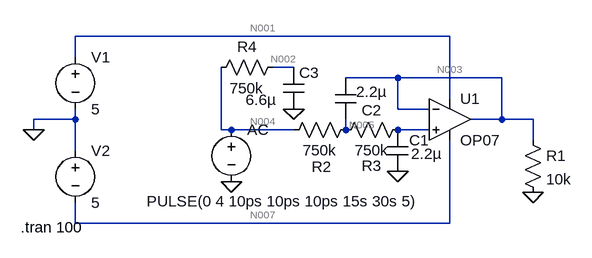
[diagram p0: schematic Draft2.asc]
Draft2.asc, the LTspice schematic file:
Version 4
SHEET 1 880 680
WIRE 176 32 -400 32
WIRE -400 64 -400 32
WIRE -64 80 -96 80
WIRE 96 96 16 96
WIRE 256 96 96 96
WIRE 176 128 176 32
WIRE 96 144 96 96
WIRE 144 144 96 144
WIRE -400 160 -400 144
WIRE -400 160 -464 160
WIRE 256 160 256 96
WIRE 256 160 208 160
WIRE 304 160 256 160
WIRE -464 176 -464 160
WIRE -176 176 -176 80
WIRE -160 176 -176 176
WIRE -64 176 -160 176
WIRE 16 176 16 160
WIRE 144 176 96 176
WIRE 304 192 304 160
WIRE -400 208 -400 160
WIRE -400 320 -400 288
WIRE 176 320 176 192
WIRE 176 320 -400 320
FLAG -464 176 0
FLAG 304 272 0
FLAG 96 240 0
FLAG -160 256 0
FLAG -64 144 0
SYMBOL Opamps\\OP07 176 96 R0
SYMATTR InstName U1
SYMBOL voltage -400 48 R0
WINDOW 123 0 0 Left 2
WINDOW 39 0 0 Left 2
SYMATTR InstName V1
SYMATTR Value 5
SYMBOL voltage -400 192 R0
WINDOW 123 0 0 Left 2
WINDOW 39 0 0 Left 2
SYMATTR InstName V2
SYMATTR Value 5
SYMBOL res 288 176 R0
SYMATTR InstName R1
SYMATTR Value 10k
SYMBOL res 32 160 R90
WINDOW 0 88 53 VBottom 2
WINDOW 3 32 56 VTop 2
SYMATTR InstName R2
SYMATTR Value 750k
SYMBOL cap 112 240 R180
WINDOW 0 -32 48 Left 2
WINDOW 3 -52 27 Left 2
SYMATTR InstName C1
SYMATTR Value 2.2µ
SYMBOL cap 32 160 R180
WINDOW 0 -39 14 Left 2
WINDOW 3 -47 43 Left 2
SYMATTR InstName C2
SYMATTR Value 2.2µ
SYMBOL res 112 160 R90
WINDOW 0 87 56 VBottom 2
WINDOW 3 32 56 VTop 2
SYMATTR InstName R3
SYMATTR Value 750k
SYMBOL voltage -160 160 R0
WINDOW 3 -130 126 Left 2
WINDOW 123 24 44 Left 2
WINDOW 39 0 0 Left 2
SYMATTR InstName AC
SYMATTR Value PULSE(0 4 10ps 10ps 10ps 15s 30s 5)
SYMBOL cap -80 80 R0
WINDOW 3 -58 50 Left 2
SYMATTR InstName C3
SYMATTR Value 6.6µ
SYMBOL res -80 64 R90
WINDOW 0 0 56 VBottom 2
WINDOW 3 32 56 VTop 2
SYMATTR InstName R4
SYMATTR Value 750k
TEXT -484 326 Left 2 !.tran 100

The netlist it stands for:
* Draft2.asc
XU1 N006 N003 N001 N007 N003 LT1001  ; OP07, pins In+ In- V+ V- OUT
V1 N001 0 5
V2 0 N007 5
R1 N003 0 10k
R2 N005 N004 750k
C1 0 N006 2.2µ
C2 N005 N003 2.2µ
R3 N006 N005 750k
V§AC N004 0 PULSE(0 4 10ps 10ps 10ps 15s 30s 5)
C3 N002 0 6.6µ
R4 N002 N004 750k
.tran 100
.lib LTC.lib
.backanno
.end

* Results of the author's LTspice run, read from the files saved beside the schematic
* Operating Point, zero values left out:
*   V(n001) = 5 V
*   V(n007) = -5 V
*   I(V2) = -2.25 mA
*   I(V1) = -2.25 mA
*   Ix(u1:3) = 2.25 mA
*   Ix(u1:4) = -2.25 mA
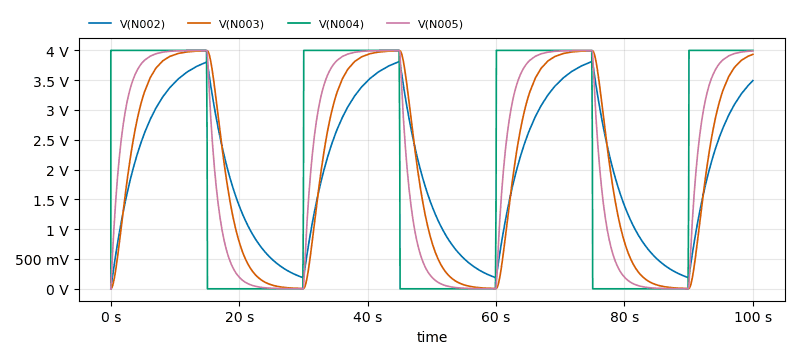
[diagram p1: Transient Analysis of Draft2.asc, plotted from the saved traces]
* Transient Analysis, 1 run:
*   V(N002): min 0 V, max 3.812 V, average 2.026 V, rms 2.376 V, last 3.493 V
*   V(N003): min -21.14 µV, max 3.994 V, average 2.068 V, rms 2.625 V, last 3.933 V
*   V(N004): min 0 V, max 4 V, average 2.2 V, rms 2.963 V, last 4 V
*   V(N005): min -19.08 µV, max 3.999 V, average 2.134 V, rms 2.759 V, last 3.99 V